# EAGLE design mc (EAGLE 9.6.2)
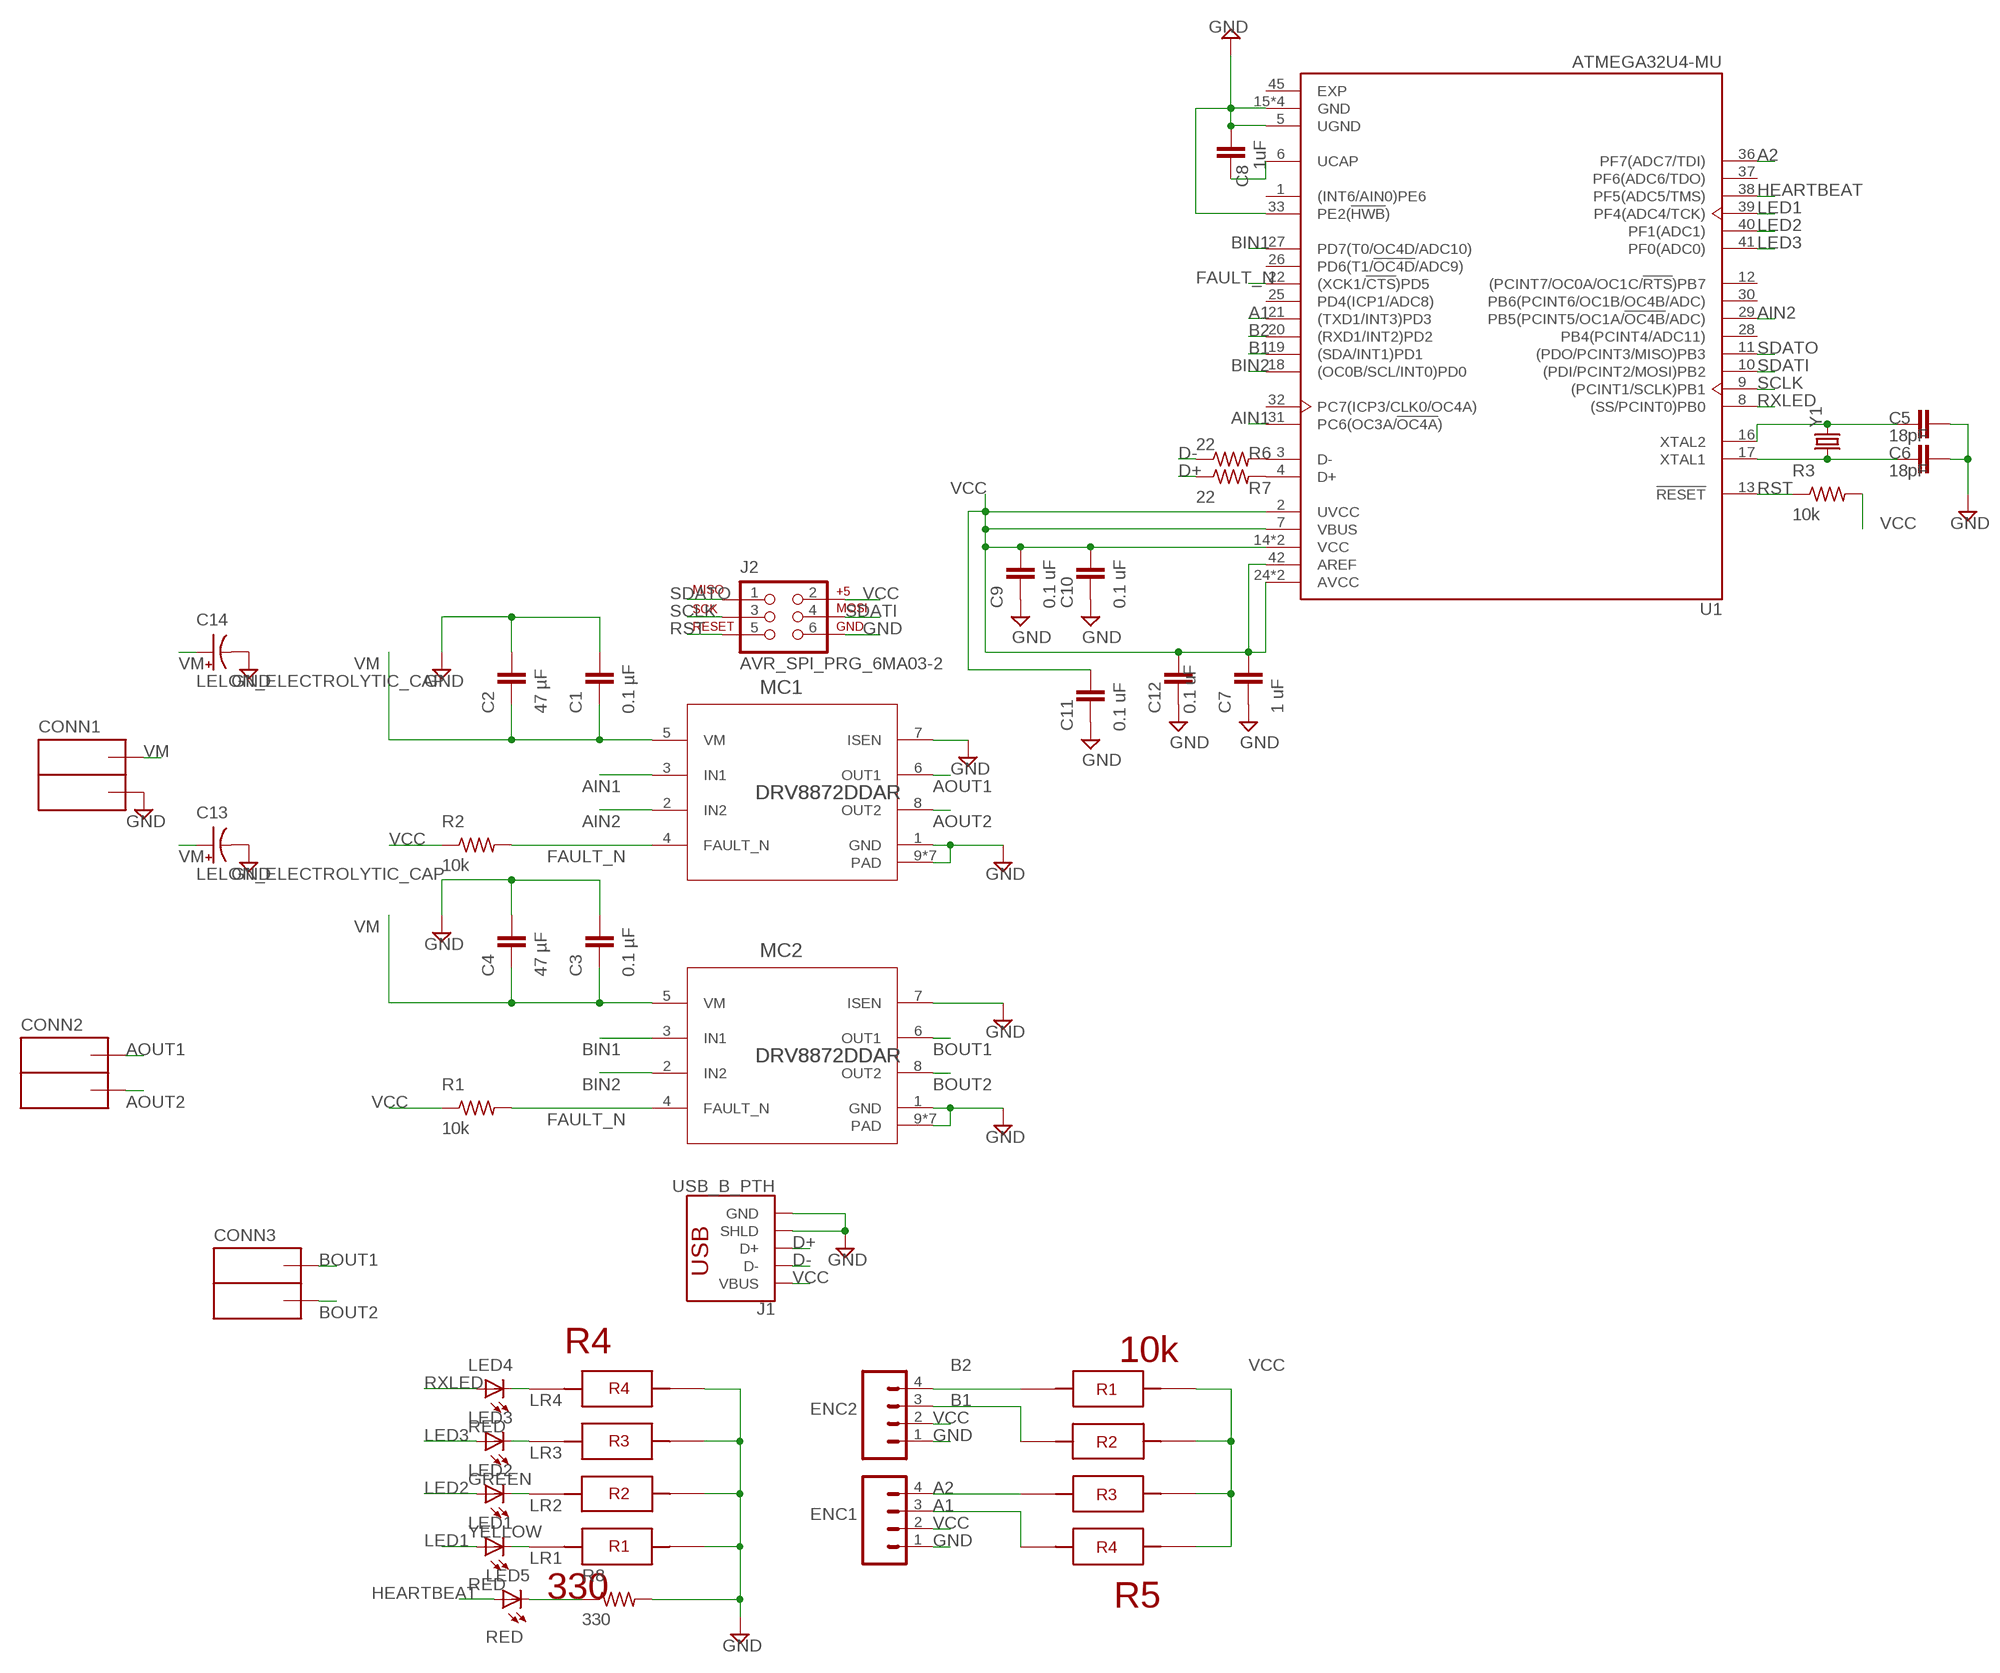
[diagram p0: schematic, sheet 1]

## Parts
C1  0.1 µF  CAP0603-CAP  [0603-CAP]
C2  47 µF  CAP1206  [1206]
C3  0.1 µF  CAP0603-CAP  [0603-CAP]
C4  47 µF  CAP1206  [1206]
C5  18pF  CAP0603-CAP  [0603-CAP]
C6  18pF  CAP0603-CAP  [0603-CAP]
C7  1 uF  CAP0603-CAP  [0603-CAP]
C8  1uF  CAP0603-CAP  [0603-CAP]
C9  0.1 uF  CAP0402-CAP  [0402-CAP]
C10  0.1 uF  CAP0402-CAP  [0402-CAP]
C11  0.1 uF  CAP0402-CAP  [0402-CAP]
C12  0.1 uF  CAP0402-CAP  [0402-CAP]
C13  LELON_ELECTROLYTIC_CAP  [LELON_CAP]
C14  LELON_ELECTROLYTIC_CAP  [LELON_CAP]
CONN1  ANDERSONVERTICAL  [ANDERSON_VERTICAL]
CONN2  ANDERSONVERTICAL  [ANDERSON_VERTICAL]
CONN3  ANDERSONVERTICAL  [ANDERSON_VERTICAL]
ENC1  M041X04-MTA  [1X04-MTA]
ENC2  M041X04-MTA  [1X04-MTA]
J1  USB_B_PTH  [USB-B-PTH]
J2  AVR_SPI_PRG_6MA03-2  [MA03-2]
LED1  RED  LED0805  [LED-0805]
LED2  YELLOW  LED0805  [LED-0805]
LED3  GREEN  LED0805  [LED-0805]
LED4  RED  LED0805  [LED-0805]
LED5  RED  LED0805  [LED-0805]
MC1  DRV8872DDAR  [DDA0008H_N_TEX]
MC2  DRV8872DDAR  [DDA0008H_N_TEX]
R1  10k  R-US_R0603  [R0603]
R2  10k  R-US_R0603  [R0603]
R3  10k  R-US_R0603  [R0603]
R4  330  4X-0603  [4X-0603]
R5  10k  4X-0603  [4X-0603]
R6  22  R-US_R0603  [R0603]
R7  22  R-US_R0603  [R0603]
R8  330  R-US_R0603  [R0603]
U1  ATMEGA32U4-MU  [QFN50P700X700X100-45N]
Y1  CRYSTAL  [CRYSTAL-SMD-5.0X3.2-2PIN]

## Nets
A1: ENC1.3 R5.4 U1.21((TXD1/INT3)PD3)
A2: ENC1.4 R5.3 U1.36(PF7(ADC7/TDI))
AIN1: MC1.3(IN1) U1.31(PC6(OC3A/!OC4A!))
AIN2: MC1.2(IN2) U1.29(PB5(PCINT5/OC1A/!OC4B!/ADC))
AOUT1: CONN2.PIN2(OUTA) MC1.6(OUT1)
AOUT2: CONN2.PIN1(OUTB) MC1.8(OUT2)
B1: ENC2.3 R5.2 U1.19((SDA/INT1)PD1)
B2: ENC2.4 R5.1 U1.20((RXD1/INT2)PD2)
BIN1: MC2.3(IN1) U1.27(PD7(T0/OC4D/ADC10))
BIN2: MC2.2(IN2) U1.18((OC0B/SCL/INT0)PD0)
BOUT1: CONN3.PIN2(OUTA) MC2.6(OUT1)
BOUT2: CONN3.PIN1(OUTB) MC2.8(OUT2)
D+: J1.D+ R7.1
D-: J1.D- R6.1
FAULT_N: MC1.4(FAULT_N) MC2.4(FAULT_N) R1.2 R2.2 U1.22((XCK1/!CTS!)PD5)
GND: C1.2 C2.2 C3.2 C4.2 C5.2 C6.2 C7.1 C8.2 C9.1 C10.1 C11.1 C12.1 C13.P$2(-) C14.P$2(-) CONN1.PIN1(OUTB) ENC1.1 ENC2.1 J1.GND J1.SHLD1(SHLD) J1.SHLD2(SHLD) J2.6 MC1.1(GND) MC1.7(ISEN) MC1.9(PAD) MC1.P$1(PAD) MC1.P$2(PAD) MC1.P$3(PAD) MC1.P$4(PAD) MC1.P$5(PAD) MC1.P$6(PAD) MC2.1(GND) MC2.7(ISEN) MC2.9(PAD) MC2.P$1(PAD) MC2.P$2(PAD) MC2.P$3(PAD) MC2.P$4(PAD) MC2.P$5(PAD) MC2.P$6(PAD) R4.1 R4.2 R4.3 R4.4 R8.2 U1.5(UGND) U1.15(GND) U1.23(GND) U1.33(PE2(!HWB!)) U1.35(GND) U1.43(GND)
HEARTBEAT: LED5.A U1.38(PF5(ADC5/TMS))
LED1: LED1.A U1.39(PF4(ADC4/TCK))
LED2: LED2.A U1.40(PF1(ADC1))
LED3: LED3.A U1.41(PF0(ADC0))
LR1: LED1.C R4.8
LR2: LED2.C R4.7
LR3: LED3.C R4.6
LR4: LED4.C R4.5
N$1: C6.1 U1.17(XTAL1) Y1.P$2
N$2: R7.2 U1.4(D+)
N$4: R6.2 U1.3(D-)
N$5: C8.1 U1.6(UCAP)
N$6: C5.1 U1.16(XTAL2) Y1.P$1
N$10: LED5.C R8.1
RST: J2.5 R3.1 U1.13(!RESET!)
RXLED: LED4.A U1.8((SS/PCINT0)PB0)
SCLK: J2.3 U1.9((PCINT1/SCLK)PB1)
SDATI: J2.4 U1.10((PDI/PCINT2/MOSI)PB2)
SDATO: J2.1 U1.11((PDO/PCINT3/MISO)PB3)
VCC: C7.2 C9.2 C10.2 C11.2 C12.2 ENC1.2 ENC2.2 J1.VBUS J2.2 R1.1 R2.1 R3.2 R5.5 R5.6 R5.7 R5.8 U1.2(UVCC) U1.7(VBUS) U1.14(VCC) U1.24(AVCC) U1.34(VCC) U1.42(AREF) U1.44(AVCC)
VM: C1.1 C2.1 C3.1 C4.1 C13.P$1(+) C14.P$1(+) CONN1.PIN2(OUTA) MC1.5(VM) MC2.5(VM)
Unconnected: U1.1((INT6/AIN0)PE6) U1.12((PCINT7/OC0A/OC1C/!RTS!)PB7) U1.25(PD4(ICP1/ADC8)) U1.26(PD6(T1/!OC4D!/ADC9)) U1.28(PB4(PCINT4/ADC11)) U1.30(PB6(PCINT6/OC1B/OC4B/ADC)) U1.32(PC7(ICP3/CLK0/OC4A)) U1.37(PF6(ADC6/TDO)) U1.45(EXP)

## Library data of the parts
C1 C3 C5-C12 = pie:CAP: Capacitor Standard 0603 ceramic capacitor, and 0.1" leaded capacitor.; PIE-INT-REF-NUM: CAPACITOR-GENERIC
C2 C4 = pie:CAP: Capacitor Standard 0603 ceramic capacitor, and 0.1" leaded capacitor.
C13 C14 = pie:LELON_ELECTROLYTIC_CAP
CONN1-CONN3 = pie:ANDERSON: 2-pin 25A Anderson Connector http://www.alliedelec.com/images/products/datasheets/bm/ANDERSON_POWER_PRODUCTS/70162018.pdf; PIE-INT-REF-NUM: Anderson
ENC1 ENC2 = pie:M04: 4-pin 0.1-inch header and MTA connector; PIE-INT-REF-NUM: MTA
J1 = pie:USB_B: USB Type B Connector SparkFun Products: SparkFun Stepoko <https://www.sparkfun.com/products/13899> PTH; PROD_ID: CONN-08278; SF_ID: PRT-00139
J2 = pie:AVR_SPI_PRG_6: AVR ISP 6 Pin This is the reduced ISP connector for AVR programming. Common on Arduino. This footprint will take up less PCB space and can be used with a 10-pin to 6-pin adapter such as SKU: BOB-08508; PIE-INT-REF-NUM: BULK-STOCK
LED1-LED5 = pie:LED: LEDs Standard schematic elements and footprints for 5mm, 3mm, 1206, and 0603 sized LEDs. 5mm - Spark Fun Electronics SKU : COM-00529 (and others); PIE-INT-REF-NUM: LED
MC1 MC2 = pie:DRV8872DDAR; BUILT_BY: Texas_Instrument_Team; MANUFACTURER_PART_NUMBER: DRV8872DDAR; SOURCELIBRARY: TI_2019-01-17; VENDOR: Texas Instruments
R1-R3 R6-R8 = pie:R-US_: RESISTOR, American symbol; DESCRIPTION: RESISTOR, American symbol; DISTRIBUTOR: DigiKey; MANUFACTURER: Rohm Semiconductor; NOTES: Cut Tape; PACKAGE: R0603; VALUE: >VALUE
R4 R5 = pie:4X-0603: 330: https://www.digikey.com/product-detail/en/panasonic-electronic-components/EXB-38V331JV/Y9331CT-ND/256586 10k: https://www.digikey.com/product-detail/en/panasonic-electronic-components/EXB-38V103JV/Y9103CT-ND/256604
U1 = ATMEGA32U4-MU:ATMEGA32U4-MU: 8-bit Microcontrollers - MCU AVR USB 32K FLASH INDUSTRIA Check availability <https://pricing.snapeda.com/parts/ATMEGA32U4-MU/Microchip/view-part?ref=eda>; AVAILABILITY: In Stock; DESCRIPTION: IC, 8-BIT MCU, ASSP AVR, 16MHZ, 44-VQFN; Controller Family/Series:AVR MEGA; Core Size:8bit; No. of I/O's:26; Supply Voltage Range:2.7V to 5.5V; Digital IC Case Style:VQFN; No. of Pins:44; Program Memory Size:32 KB ;RoHS Compliant: Yes; MF: Microchip; MP: ATMEGA32U4-MU; PACKAGE: VQFN-44 Atmel; PRICE: None; PURCHASE-URL: https://pricing.snapeda.com/search/part/ATMEGA32U4-MU/?ref=eda
Y1 = pie:CRYSTAL: Various standard crystals. Proven footprints. Spark Fun Electronics SKU : COM-00534

## Board
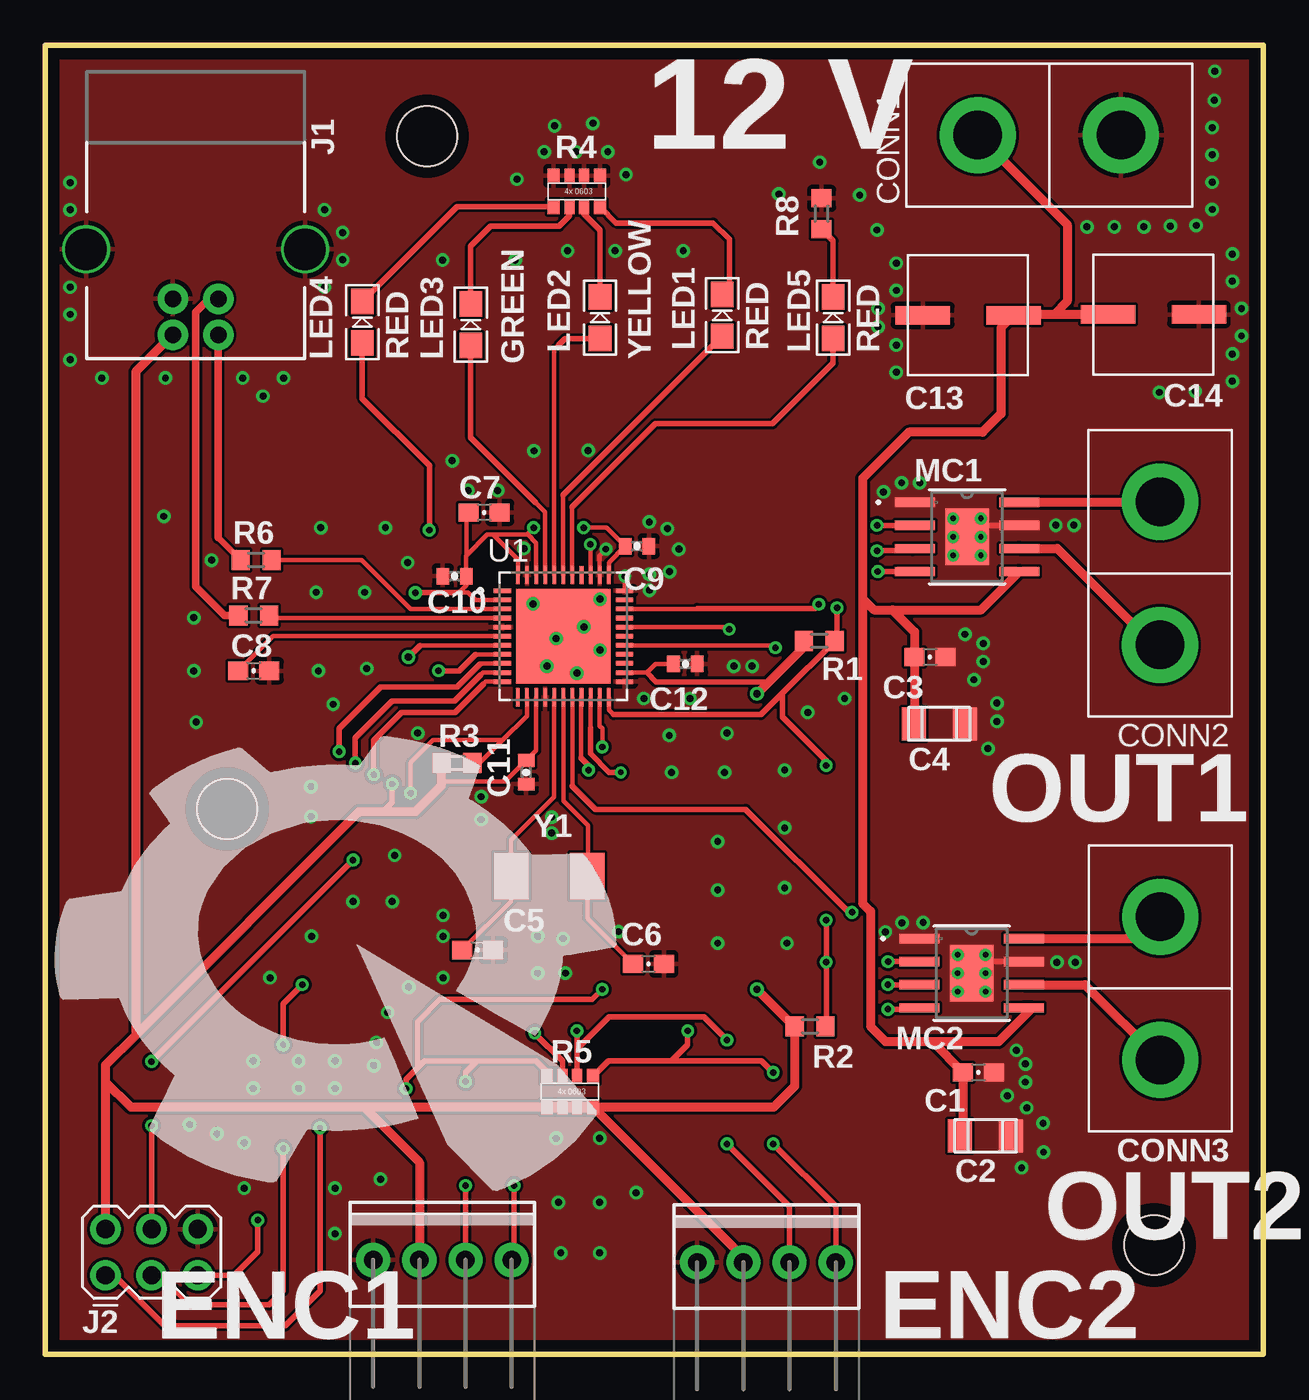
[diagram p1: board, top side]
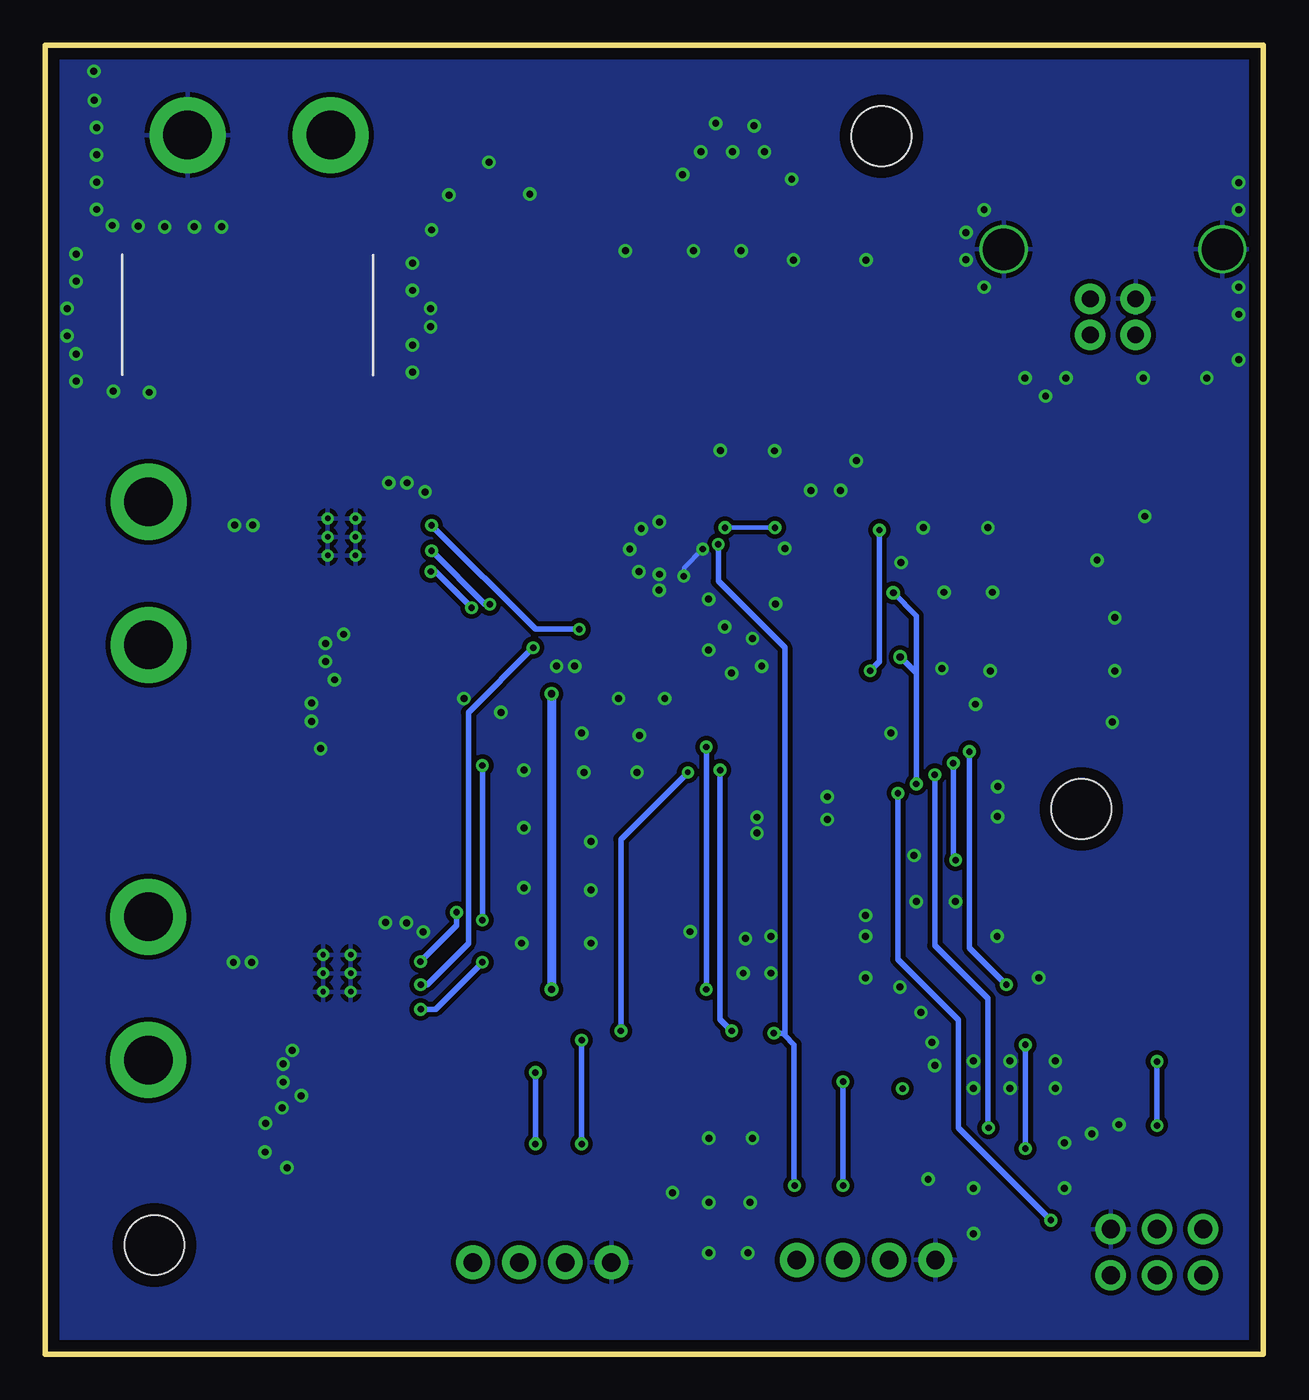
[diagram p2: board, bottom side, seen from below]

Size 67 x 72 mm. Coordinates in mm from the lower left corner, seen from the top.
Outline: 0,0 67,0 67,72 0,72 0,0
Copper layers (1*16): Top 2mil / dielectric 9mil / Bottom 2mil
Design rules "pie_jlc": minimum track width 6mil, minimum drill 0.199896875mm, track to track 6mil, track to pad 6mil, pad to pad 6mil, via to via 6mil, smd to smd 6mil, copper to edge 25mil, drill to drill 7mil, minimum pad ring 7mil, minimum via ring 7mil, stop-mask expansion 3mil, vias tented up to drill 21mil, thermal gap 10mil

### Footprints (pad centres in the part's own frame; a part is rotated, then mirrored left to right if it is on the bottom)
0603-CAP = smd 1.1 x 1: 1 -0.85,0; 2 0.85,0
1206 = smd 1.306 x 1.8: 1 -1.403,0; 2 1.403,0
0402-CAP = smd 0.7 x 0.9: 1 -0.65,0; 2 0.65,0
LELON_CAP = smd 3 x 1: P$1 -2.5,0; P$2 2.5,0
ANDERSON_VERTICAL = drill 2.667 pad 4.191: PIN1 0,-3.937; PIN2 0,3.937
1X04-MTA = drill 1.016 pad 1.88: 1 -3.81,0; 2 -1.27,0; 3 1.27,0; 4 3.81,0
USB-B-PTH = drill 0.914 pad 1.676: D+ 4,1.25; D- 5.981,1.25; GND 4,-1.25; VBUS 5.981,-1.25 | drill 2.286: SHLD1 1.282,-6.02; SHLD2 1.282,6.02
MA03-2 = drill 1 pad 1.676: 1 -2.54,-1.27; 2 -2.54,1.27; 3 0,-1.27; 4 0,1.27; 5 2.54,-1.27; 6 2.54,1.27
LED-0805 = smd 1.397 x 1.245: A -1.143,0; C 1.143,0
DDA0008H_N_TEX = smd 2.21 x 0.508: 1 -2.875,1.905; 2 -2.875,0.635; 3 -2.875,-0.635; 4 -2.875,-1.905; 5 2.875,-1.905; 6 2.875,-0.635; 7 2.875,0.635; 8 2.875,1.905 | smd 2.388 x 3.099: 9 0,0 | drill 0.3: P$1 -0.762,1.016; P$2 0.762,1.016; P$3 -0.762,0; P$4 0.762,0; P$5 -0.762,-1.016; P$6 0.762,-1.016
R0603 = smd 1 x 1.1: 1 -0.85,0; 2 0.85,0
4X-0603 = smd 0.65 x 0.8: 1 0,-0.05; 4 2.55,-0.05; 5 2.55,1.65; 8 0,1.65 | smd 0.55 x 0.8: 2 0.875,-0.05; 3 1.675,-0.05; 6 1.675,1.65; 7 0.875,1.65
QFN50P700X700X100-45N = smd 1.01 x 0.26: 1 -3.36,2.5; 2 -3.36,2; 3 -3.36,1.5; 4 -3.36,1; 5 -3.36,0.5; 6 -3.36,0; 7 -3.36,-0.5; 8 -3.36,-1; 9 -3.36,-1.5; 10 -3.36,-2; 11 -3.36,-2.5; 23 3.36,-2.5; 24 3.36,-2; 25 3.36,-1.5; 26 3.36,-1; 27 3.36,-0.5; 28 3.36,0; 29 3.36,0.5; 30 3.36,1; 31 3.36,1.5; 32 3.36,2; 33 3.36,2.5 | smd 0.26 x 1.01: 12 -2.5,-3.36; 13 -2,-3.36; 14 -1.5,-3.36; 15 -1,-3.36; 16 -0.5,-3.36; 17 0,-3.36; 18 0.5,-3.36; 19 1,-3.36; 20 1.5,-3.36; 21 2,-3.36; 22 2.5,-3.36; 34 2.5,3.36; 35 2,3.36; 36 1.5,3.36; 37 1,3.36; 38 0.5,3.36; 39 0,3.36; 40 -0.5,3.36; 41 -1,3.36; 42 -1.5,3.36; 43 -2,3.36; 44 -2.5,3.36 | smd 5.2 x 5.2: 45 0,0
STAND-OFF = hole 3.302: 0,0
CRYSTAL-SMD-5.0X3.2-2PIN = smd 1.905 x 2.54: P$1 -2.095,0; P$2 2.095,0

### Placement (x,y rotation side)
C1  51.34,15.49 0 top
C2  51.72,12.01 0 top
C3  48.67,38.35 0 top
C4  49.18,34.67 0 top
C5  23.78,22.23 0 top
C6  33.18,21.46 0 top
C7  24.14,46.31 180 top
C8  11.46,37.59 0 top
C9  32.55,44.45 180 top
C10  22.51,42.8 0 top
C11  26.45,32.01 90 top
C12  35.21,37.97 180 top
C13  50.77,57.15 180 top
C14  60.96,57.2 0 top
CONN1  55.24,67.06 90 top
CONN2  61.33,42.95 180 top
CONN3  61.34,20.12 180 top
ENC1  21.84,5.17 0 top
ENC2  39.67,5.05 0 top
J1  8.26,62.06 270 top
J2  5.84,5.6 0 top
LED1  37.24,57.15 90 top
LED2  30.51,57.02 90 top
LED3  23.4,56.64 90 top
LED4  17.43,56.77 90 top
LED5  43.34,57.02 90 top
MC1  50.71,44.96 0 top
MC2  50.96,20.96 0 top
R1  42.58,39.24 0 top
R2  42.07,18.04 0 top
R3  22.64,32.51 180 top
R4  30.51,64.77 180 top
R5  30.13,15.24 180 top
R6  11.59,43.69 0 top
R7  11.46,40.64 0 top
R8  42.7,62.74 90 top
U1  28.5,39.5 0 top
U$1  [STAND-OFF]  10,30 90 top
U$2  [STAND-OFF]  61,6 0 top
U$4  [STAND-OFF]  21,67 0 top
U$5  [PIE-LOGO]  17.02,22.32 0 top
Y1  27.72,26.29 0 top

### Tracks (layer width: path | path; a pad name or v marks a point on that pad's centre or on a via)
A1  (via drill 0.35, 0.35 pad 0.33)
  Top 0.254: 30.64,33.45 30.64,34.42 30.5,34.56 U1.21
  Top 0.305: R5.4 27.58,15.54 27,16.13 23.75,16.13 | 20.48,15.75 20.86,16.13 23.75,16.13 | 20.48,15.75 19.84,15.11 v19.84,14.61 | 30.64,33.45 v30.64,33.4 | 20.48,15.75 20.48,18.29 21.7,19.51 30.08,19.51 v30.64,20.07 | 23.75,16.13 23.11,15.49 v23.11,14.99 | v23.11,9.27 ENC1.3
  Bottom 0.305: v30.64,33.4 v30.64,20.07 | v23.11,14.99 v23.11,9.27
A2  (via drill 0.35, 0.35 pad 0.33)
  Top 0.254: v29.98,44.55 30,44.53 U1.36
  Top 0.305: v29.98,44.55 | v25.78,9.27 25.78,5.3 ENC1.4 | v26.92,17.65 28.46,16.12 R5.3
  Bottom 0.305: v29.98,44.55 29.98,42.52 26.32,38.86 26.32,17.53 | v25.78,9.27 25.81,9.3 25.81,17.02 26.32,17.53 | 26.32,17.53 26.45,17.65 v26.92,17.65
AIN1  (via drill 0.35)
  Top 0.254: U1.31 35.84,41 35.87,41.02
  Top 0.305: v42.55,41.25 42.33,41.02 35.87,41.02 | MC1.3 47.7,44.2 v45.75,44.2
  Bottom 0.305: v45.75,44.2 42.81,41.25 v42.55,41.25
AIN2  (via drill 0.35 pad 0.33)
  Top 0.254: U1.29 37.49,40 v37.62,39.87
  Top 0.305: v37.62,39.87 v37.62,39.88 | MC1.2 v45.75,45.59
  Bottom 0.305: v37.62,39.88 40.04,39.88 v45.75,45.59
AOUT1
  Top 0.508: CONN2.PIN2 60.98,39.02 55.67,44.32 MC1.6
AOUT2
  Top 0.508: CONN2.PIN1 61.3,46.86 MC1.8
B1  (via drill 0.35 pad 0.33)
  Top 0.254: 29.48,32.78 29.48,36.12 U1.19
  Top 0.305: R5.2 29.26,16.78 | v37.5,17.27 36.23,18.54 31.02,18.54 29.26,16.78 | v37.5,11.56 40.94,8.12 ENC2.3 | 29.48,32.78 29.88,32.39 v29.88,32.13 | 29.26,16.78 29.24,16.79 v29.24,17.78
  Bottom 0.305: v37.5,17.27 v37.5,11.56 | v29.88,32.13 29.88,18.42 v29.24,17.78
B2  (via drill 0.3 pad 0.33, 0.35 pad 0.33)
  Top 0.254: 29.98,34.45 29.98,36.12 U1.20
  Top 0.305: R5.1 30.97,16.13 34.45,16.13 | v40.04,15.49 39.4,16.13 34.45,16.13 | v40.04,11.56 43.48,8.12 ENC2.4 | 34.45,16.13 35.34,17.02 v35.34,17.78 | 29.98,34.45 29.98,33.05 31.02,32.01 v31.66,32.01
  Bottom 0.305: v40.04,15.49 v40.04,11.56 | v35.34,17.78 35.34,28.32 v31.66,32.01
BIN1  (via drill 0.35, 0.35 pad 0.33)
  Top 0.254: U1.27 40.03,39 v40.16,38.86
  Top 0.305: 40.16,38.87 v40.16,38.86 | MC2.3 v46.35,20.32
  Bottom 0.305: v40.16,38.86 43.72,35.31 43.72,22.61 46.01,20.32 v46.35,20.32
BIN2  (via drill 0.35)
  Top 0.254: U1.18 29,31.27 28.98,31.25
  Top 0.305: v46.36,21.59 MC2.2 | 28.98,31.25 30.26,29.97 38.53,29.97 44.2,24.3 v44.38,24.3
  Bottom 0.305: v44.38,24.3 44.38,23.57 v46.36,21.59
BOUT1
  Top 0.508: MC2.6 57.2,20.32 CONN3.PIN2
BOUT2
  Top 0.508: MC2.8 60.14,22.86 CONN3.PIN1
D+
  Top 0.406: J1.D+ 9,58.06 8.28,57.34 8.28,50.93 8.28,42.22 9.85,40.64 R7.1
D-
  Top 0.305: R6.1 9.51,44.92
  Top 0.406: 9.51,44.92 J1.D-
FAULT_N  (via drill 0.35, 0.35 pad 0.33)
  Top 0.254: 31.26,35.18 31,35.45 U1.22
  Top 0.305: 40.55,36.36 R1.2 43.55,39.37 v43.55,41.06 | 40.55,36.36 39.36,35.18 31.26,35.18 | MC1.4 v45.8,43.05 | R2.2 42.96,18.07 v42.96,21.56 v42.96,23.88 | MC2.4 47.53,19.05 47.45,18.97 v46.35,18.97 | v42.96,32.39 42.96,32.64 40.55,35.05 40.55,36.36
  Bottom 0.305: v42.96,32.39 v42.96,23.88 | v45.8,43.05 45.55,43.05 v43.55,41.06 | v42.96,21.56 45.55,18.97 v46.35,18.97
GND  (via drill 0.35, 0.38 pad 0.33)
  Top 0.254: U1.35 30.5,43.95 v30.84,44.29 | v31.88,42.8 31.88,42.02 U1.33
  Top 0.305: MC1.9 51.34,45.59 MC1.7 | MC2.9 51.59,21.59 MC2.7
  Bottom 0.254: v30.84,44.29 31.88,43.25 v31.88,42.8
  other vias: 54.89,12.7 53.71,10.26 53.99,13.54 53.42,16.71 48.29,23.74 47.13,23.73 46.22,23.23 52.36,35.81 51.59,38.1 61.29,52.91 63.26,52.97 64.34,70.58 64.31,68.98 25.94,64.64 30.12,67.71 44.8,63.77 28.01,67.57 21.85,60.2 28.73,60.7 40.35,63.83 45.75,61.85 46.11,47.44 33.22,45.78 29.86,49.72 26.88,49.69 22.39,49.15 11.97,52.71 40.67,32.13 40.67,28.96 40.67,25.66 40.8,22.61 36.99,22.61 36.99,25.53 36.99,28.2 37.37,32.01 34.45,32.01 37.88,37.85 41.94,35.31 43.98,36.07 37.5,34.16 34.32,34.04 27.08,22.99 28.48,22.86 28.61,20.96 27.08,20.96 19.99,20.19 18.07,15.88 18.22,17.15 18.83,18.8 16.92,24.89 19.08,24.89 19.21,27.43 14.64,22.99 12.35,20.7 8.3,34.77 14.62,29.57 14.61,31.22 15.83,35.75 17.68,37.72 15.02,37.59 20.48,34.16 17.56,41.91 14.89,41.91 18.7,45.47 15.15,45.47 6.51,46.09 9.14,43.68 30.5,11.88 30.5,8.34 30.5,5.57 28.35,5.57 28.23,8.34 28.1,11.88 8.16,40.51 8.16,37.59 32.93,36.07 35.47,36.07 29.62,40.01 26.83,41.28 27.59,37.85 29.24,37.47 30.51,38.74 28.1,39.37 11.43,16.12 11.43,14.62 13.93,14.62 13.93,16.12 15.93,16.12 15.93,14.62 10.93,11.62 10.93,9.12 7.93,12.62 9.43,12.12 18.43,9.62 15.93,9.12 15.93,6.62 32.5,8.88 55.66,21.56 56.66,21.56 55.59,45.6 56.59,45.6 64.19,67.48 64.19,65.98 64.19,64.48 64.19,62.98 63.32,62.1 61.9,62.06 60.44,62.02 58.81,62.02 57.31,62.02 65.31,60.52 65.31,59.02 65.81,57.52 65.81,56.02 65.31,55.02 65.31,53.52 46.81,54.02 46.81,55.52 45.81,56.52 45.81,57.52 46.81,58.52 46.81,60.02 47.11,47.94 48.11,47.94 50.59,39.6 51.59,39.1 51.09,37.1 52.36,34.81 51.86,33.31 53.92,15.96 53.92,14.96 52.92,14.21 54.92,11.11 42.6,65.58 25.85,60.19 31.34,60.7 35.09,60.7 27.44,66.14 29.19,66.14 30.94,66.14 31.94,64.89 24.89,47.52 23.25,47.52 19.93,43.55 27.85,29.54 27.85,28.66 23.98,30.66 23.98,29.41 38.88,37.85 34.22,45.41 34.85,44.28 33.22,42.9 33.24,42.03 34.35,43.05 15.35,62.95 16.35,61.7 16.35,60.2 15.35,58.7 1.35,58.7 1.35,62.95 1.35,64.45 1.35,57.2 1.35,54.7 3.1,53.7 6.6,53.7 10.85,53.7 13.1,53.7 21.88,20.7 21.88,22.99 21.88,24.13 31.53,23.24 26.32,44.32 30.51,41.53
  pour Bottom (isolate 0.254): -2.74,75.72 71.53,75.72 71.53,-3.81 -2.74,-3.81
  pour Top (rank 2): -6.48,79.78 74.45,79.78 74.45,-7.62 -6.48,-7.62
  pour Top (no thermals): 45.72,48.01 45.72,32.38 55.63,32.38 55.63,48.01
  pour Top (no thermals): 46.48,24.38 46.48,8.76 56.39,8.76 56.39,24.38
HEARTBEAT
  Top 0.254: 28.98,46.6 28.98,42.87 U1.38
  Top 0.305: 28.98,46.6 33.56,51.18 40.01,51.18 43.34,54.51 LED5.A
LED1
  Top 0.254: 28.48,47.27 28.48,42.87 U1.39
  Top 0.305: LED1.A 37.22,56.01 28.48,47.27
LED2
  Top 0.254: 28.23,55.52 28,55.28 U1.40
  Top 0.305: 28.23,55.52 28.6,55.88 LED2.A
LED3
  Top 0.254: 26.97,46.85 27.5,46.32 U1.41
  Top 0.305: 26.97,46.85 23.4,50.42 LED3.A
LR1
  Top 0.305: R4.8 31.4,62.23 36.74,62.23 37.62,61.34 37.62,58.67 LED1.C
LR2
  Top 0.305: R4.7 29.64,62.72 30.51,61.84 LED2.C
LR3
  Top 0.305: LED3.C 23.4,60.96 24.48,62.04 28.26,62.04 28.84,62.62 R4.6
LR4
  Top 0.305: LED4.C 22.64,63.12 R4.5
N$1
  Top 0.254: U1.17 28.5,30.43 29.84,29.08 29.84,26.32 Y1.P$2 29.81,23.98 C6.1
N$2
  Top 0.254: U1.4 12.46,40.5 R7.2
N$4
  Top 0.254: U1.3 20.09,41 17.4,43.69 R6.2
N$5
  Top 0.254: U1.6 12.52,39.5 C8.1
N$6
  Top 0.254: U1.16 28,30.66 25.62,28.29 Y1.P$1 25.62,24.92 C5.1
N$10
  Top 0.305: LED5.C 43.34,61.25 R8.1
RST  (via drill 0.35, 0.35 pad 0.33)
  Top 0.254: U1.13 26.5,35.12 25.16,33.78 | 25.16,33.78 21.34,33.78 20.1,32.55 v20.1,30.86 | R3.1 23.89,32.51 25.16,33.78
  Top 0.305: v20.1,30.86 20.14,30.86 | v11.68,7.37 11.68,5.64 10.38,4.33 J2.5
  Bottom 0.305: v20.1,30.86 20.1,21.72 16.76,18.38 16.76,12.45 v11.68,7.37
RXLED  (via drill 0.35 pad 0.33)
  Top 0.254: 23.67,38.5 U1.8
  Top 0.305: v21.11,45.34 21.11,45.59 21.14,45.62 21.14,48.87 17.43,52.58 LED4.A | 23.67,38.5 22.77,37.59 v21.62,37.59
  Bottom 0.305: v21.62,37.59 21.11,38.1 v21.11,45.34
SCLK  (via drill 0.35, 0.35 pad 0.33)
  Top 0.254: 23.91,37.97 23.93,38 U1.9
  Top 0.305: 23.91,37.97 22.64,36.7 18.45,36.7 16.16,34.42 v16.16,33.15 | v13.08,17.02 13.08,19.27 v14.13,20.32 | v13.08,11.3 13.08,3.48 12.3,2.7 7.97,2.7 6.33,4.33 J2.3
  Bottom 0.305: v16.16,33.15 16.16,22.35 v14.13,20.32 | v13.08,17.02 v13.08,11.3
SDATI  (via drill 0.35, 0.35 pad 0.33)
  Top 0.254: 23.95,37.37 24.08,37.5 U1.10
  Top 0.305: v17.05,32.51 17.05,33.91 19.08,35.94 22.52,35.94 23.95,37.37 | v16.92,27.18 v5.84,16.1 | v5.84,12.57 J2.4
  Bottom 0.305: v17.05,32.51 17.05,27.31 v16.92,27.18 | v5.84,16.1 v5.84,12.57
SDATO  (via drill 0.35, 0.35 pad 0.33)
  Top 0.254: 24.1,36.87 24.23,37 U1.11
  Top 0.305: 24.1,36.87 22.54,35.31 19.6,35.31 18.07,33.77 v18.07,31.88 | v15.11,12.45 15.11,3.48 13.19,1.56 6.57,1.56 3.79,4.33 J2.1
  Bottom 0.305: v18.07,31.88 18.07,22.48 15.15,19.56 15.15,12.48 v15.11,12.45
VCC  (via drill 0.35, 0.35 pad 0.33, 0.38 pad 0.33, 0.4 pad 0.33)
  Top 0.254: U1.34 31,43.55 C9.2 30.88,45.47 v29.61,45.47 | U1.24 33.08,37.5 33.09,37.5 33.56,37.97 C12.2 | U1.14 27,33.2 C11.2 25.29,31.5 22,31.5 21.79,31.28 21.71,31.2 | C7.2 23.16,46.18 23.16,43.94 | U1.44 26,43.73 24.64,45.09 | 23.16,43.94 24.3,45.09 24.64,45.09 | 23.16,43.94 23.15,43.93 23.15,42.81 C10.2 23.16,42.31 22.77,41.91 23.24,41.91 23.65,41.5 U1.2 | U1.42 27,44.63 26.54,45.09 | 24.64,45.09 26.54,45.09 | 26.54,45.09 26.54,45.14 v26.86,45.47 | U1.7 20.61,38.99
  Top 0.305: 20.61,38.99 v19.97,38.35 | v19.08,31.37 19.08,30.35 18.57,29.85 | 39.82,36.99 33.59,36.99 33.09,37.5 | 22.77,41.91 20.35,41.91 v20.35,41.89
  Top 0.508: 17.53,13.59 15.65,13.59 4.7,13.59 3.3,14.99 | 17.53,13.59 R5.5 | ENC2.2 38.4,5.32 R5.8 40.08,13.59 41.22,14.73 R2.1 41.18,18.04 v39.15,20.07 | R1.1 41.73,38.9 39.82,36.99 v39.15,36.32 | 21.71,31.2 20.35,29.85 18.57,29.85 17.25,29.85 5.04,17.63 | J1.VBUS 4.98,54.05 4.98,17.63 5.04,17.63 | 3.3,14.99 3.3,15.89 5.04,17.63 | 3.3,14.99 J2.2 | 17.53,13.59 20.57,10.54 ENC1.2 | 21.79,31.28 R3.2
  Top 0.61: R5.5 R5.6 R5.7 R5.8
  Bottom 0.254: v26.86,45.47 v29.61,45.47
  Bottom 0.305: v19.97,38.35 19.08,37.47 | v19.08,31.37 19.08,37.47 | 19.08,37.47 19.08,40.62 v20.35,41.89
  Bottom 0.508: v39.15,36.32 v39.15,20.07
VM
  Top 0.508: CONN1.PIN2 56.22,62.15 56.22,57.92 55.5,57.2 | C14.P$1 55.5,57.2 | 55.5,57.2 53.32,57.2 C13.P$1 52.58,56.46 52.58,51.74 51.56,50.72 47.5,50.72 44.96,48.18 44.96,41.58 | MC2.5 54.23,19.05 54.23,18.97 52.45,17.19 48.79,17.19 | 44.96,41.58 45.59,40.94 46.61,40.94 | MC1.5 51.47,40.94 46.61,40.94 | 46.61,40.94 47.82,39.73 C3.1 47.82,34.72 C4.1 | 44.96,41.58 44.96,24.8 45.39,24.36 45.39,18.03 46.23,17.19 48.79,17.19 | 48.79,17.19 C1.1 50.49,12.18 C2.1

### Text on the board
tPlace: 12 V | OUT1 | OUT2